# EAGLE design switchableMacroKeyboard (EAGLE 9.5.2)
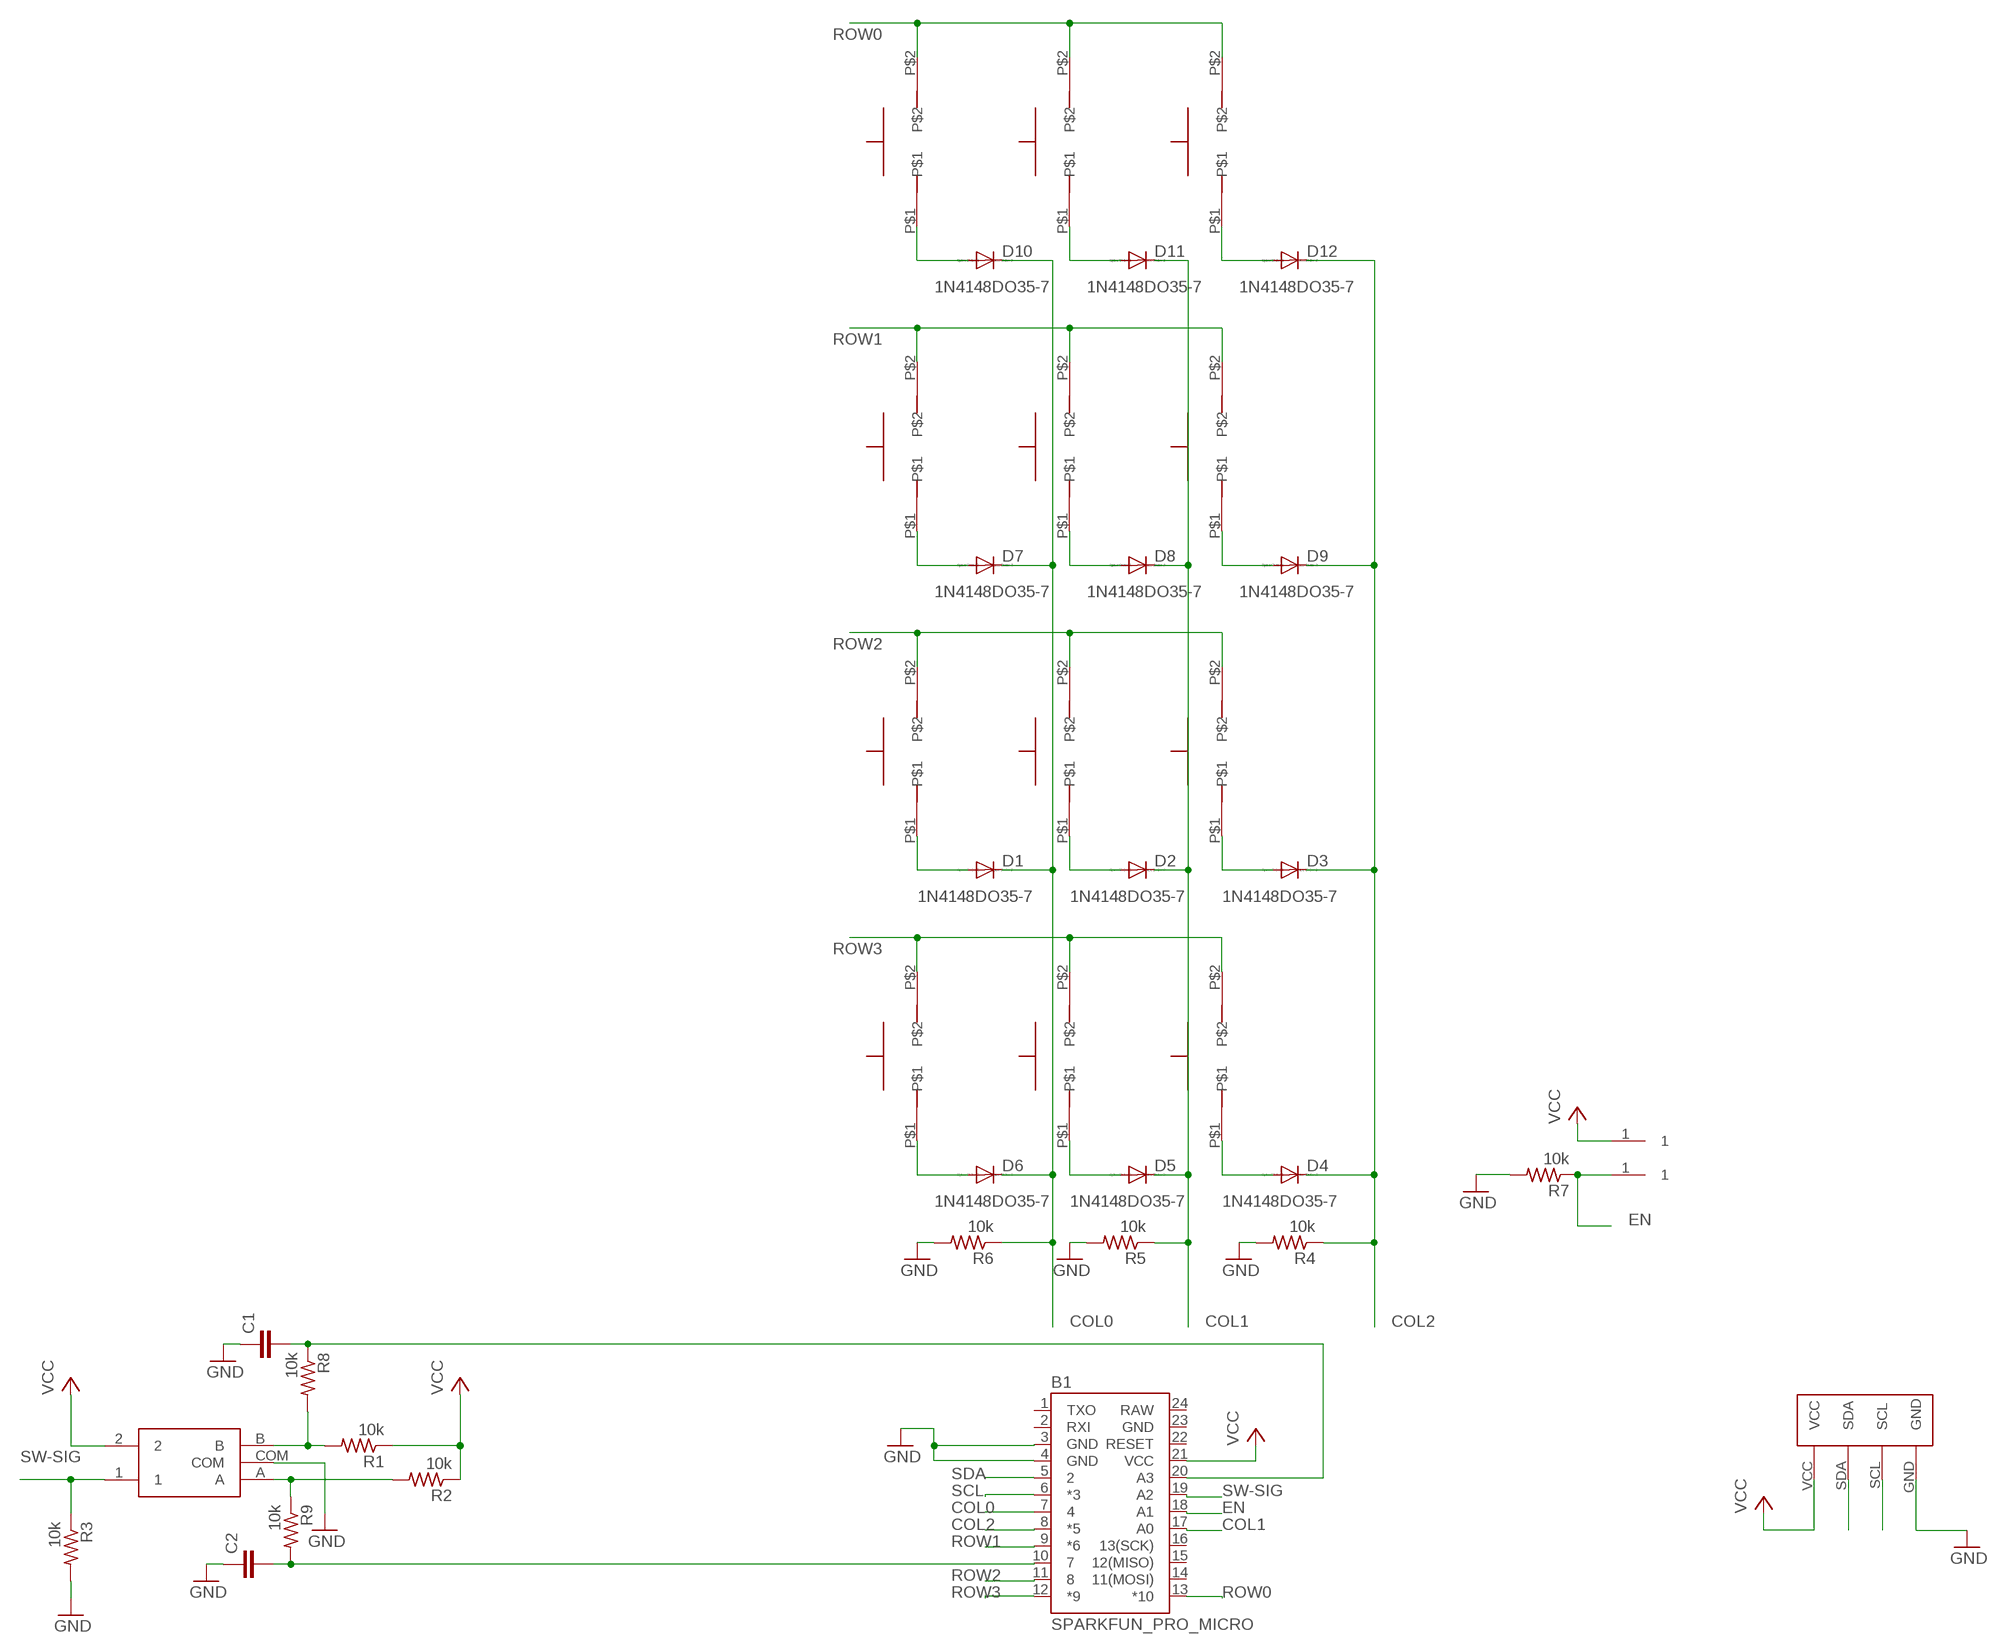
[diagram p0: schematic, sheet 1]

## Parts
B1  SPARKFUN_PRO_MICRO  [SPARKFUN_PRO_MICRO]
C1  C5/2.5  [C5B2.5]
C2  C5/2.5  [C5B2.5]
D1  1N4148DO35-7  [DO35-7]
D2  1N4148DO35-7  [DO35-7]
D3  1N4148DO35-7  [DO35-7]
D4  1N4148DO35-7  [DO35-7]
D5  1N4148DO35-7  [DO35-7]
D6  1N4148DO35-7  [DO35-7]
D7  1N4148DO35-7  [DO35-7]
D8  1N4148DO35-7  [DO35-7]
D9  1N4148DO35-7  [DO35-7]
D10  1N4148DO35-7  [DO35-7]
D11  1N4148DO35-7  [DO35-7]
D12  1N4148DO35-7  [DO35-7]
R1  10k  R-US_0207/10  [0207/10]
R2  10k  R-US_0207/10  [0207/10]
R3  10k  R-US_0207/10  [0207/10]
R4  10k  R-US_0207/10  [0207/10]
R5  10k  R-US_0207/10  [0207/10]
R6  10k  R-US_0207/10  [0207/10]
R7  10k  R-US_0207/10  [0207/10]
R8  10k  R-US_0207/10  [0207/10]
R9  10k  R-US_0207/10  [0207/10]
U$1  TESTPOINT  [TESTPOINT]
U$2  TESTPOINT  [TESTPOINT]
U$3  I2C-100MIL  [I2C-100MIL]
U$4  CHERRYMXBLUE  [CHERRYMXBLUE]
U$5  CHERRYMXBLUE  [CHERRYMXBLUE]
U$6  CHERRYMXBLUE  [CHERRYMXBLUE]
U$7  CHERRYMXBLUE  [CHERRYMXBLUE]
U$8  CHERRYMXBLUE  [CHERRYMXBLUE]
U$9  CHERRYMXBLUE  [CHERRYMXBLUE]
U$10  CHERRYMXBLUE  [CHERRYMXBLUE]
U$11  CHERRYMXBLUE  [CHERRYMXBLUE]
U$12  CHERRYMXBLUE  [CHERRYMXBLUE]
U$13  RE-PEC11R-4315F-S0012  [RE-PEC11R-4315F-S0012]
U$14  CHERRYMXBLUE  [CHERRYMXBLUE]
U$15  CHERRYMXBLUE  [CHERRYMXBLUE]
U$16  CHERRYMXBLUE  [CHERRYMXBLUE]

## Nets
COL0: B1.7 D1.C D6.C D7.C D10.C R6.1
COL1: B1.17(A0) D2.C D5.C D8.C D11.C R5.1
COL2: B1.8(*5) D3.C D4.C D9.C D12.C R4.1
EN: B1.18(A1) R7.1 U$2.1
GND: B1.3(GND) B1.4(GND) C1.1 C2.1 R3.2 R4.2 R5.2 R6.2 R7.2 U$3.GND U$13.COM
N$1: B1.10 C2.2 R9.2
N$2: R1.2 R8.2 U$13.B
N$3: D1.A U$10.P$1
N$4: D2.A U$11.P$1
N$5: D3.A U$12.P$1
N$6: D6.A U$14.P$1
N$7: D5.A U$15.P$1
N$8: D4.A U$16.P$1
N$9: B1.20(A3) C1.2 R8.1
N$10: R2.2 R9.1 U$13.A
N$18: D7.A U$7.P$1
N$19: D8.A U$8.P$1
N$20: D9.A U$9.P$1
N$25: D10.A U$4.P$1
N$26: D11.A U$5.P$1
N$27: D12.A U$6.P$1
ROW0: B1.13(*10) U$4.P$2 U$5.P$2 U$6.P$2
ROW1: B1.9(*6) U$7.P$2 U$8.P$2 U$9.P$2
ROW2: B1.11 U$10.P$2 U$11.P$2 U$12.P$2
ROW3: B1.12(*9) U$14.P$2 U$15.P$2 U$16.P$2
SCL: B1.6(*3) U$3.SCL
SDA: B1.5 U$3.SDA
SW-SIG: B1.19(A2) R3.1 U$13.1
VCC: B1.21(VCC) R1.1 R2.1 U$1.1 U$3.VCC U$13.2
Unconnected: B1.1(TXO) B1.2(RXI) B1.14(11(MOSI)) B1.15(12(MISO)) B1.16(13(SCK)) B1.22(RESET)

## Power pins joined to a net without a drawn wire
GND: B1.23(GND)
RAW: B1.24(RAW)

## Library data of the parts
B1 = SparkFun-Boards:SPARKFUN_PRO_MICRO: SparkFun Pro Micro Atmega32U4 compatible footprint. SparkFun Products: 3.3V/8MHz <https://www.sparkfun.com/products/12587> 5V/16MHz <https://www.sparkfun.com/products/12640>
C1 C2 = capacitor-wima:C: CAPACITOR naming: grid - package width
D1-D12 = diode:1N4148: DIODE high speed (Philips)
R1-R9 = rcl:R-US_: RESISTOR, American symbol; SPICEPREFIX: R
U$1 U$2 = ARNEConnectors:TESTPOINT
U$3 = ARNEConnectors:I2C-100MIL
U$4-U$12 U$14-U$16 = ARNEInput:CHERRYMXBLUE
U$13 = ARNEInput:RE-PEC11R-4315F-S0012

## Board
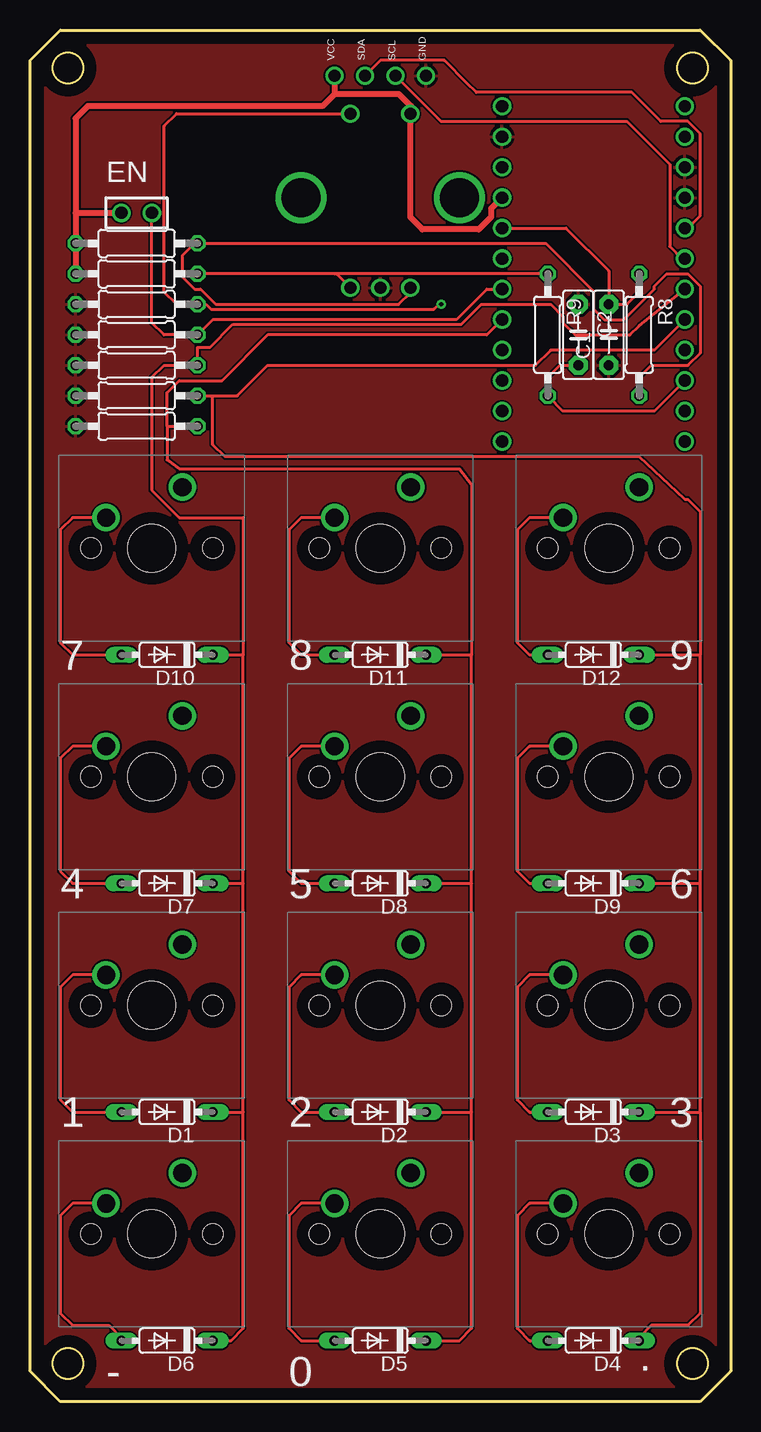
[diagram p1: board, top side]
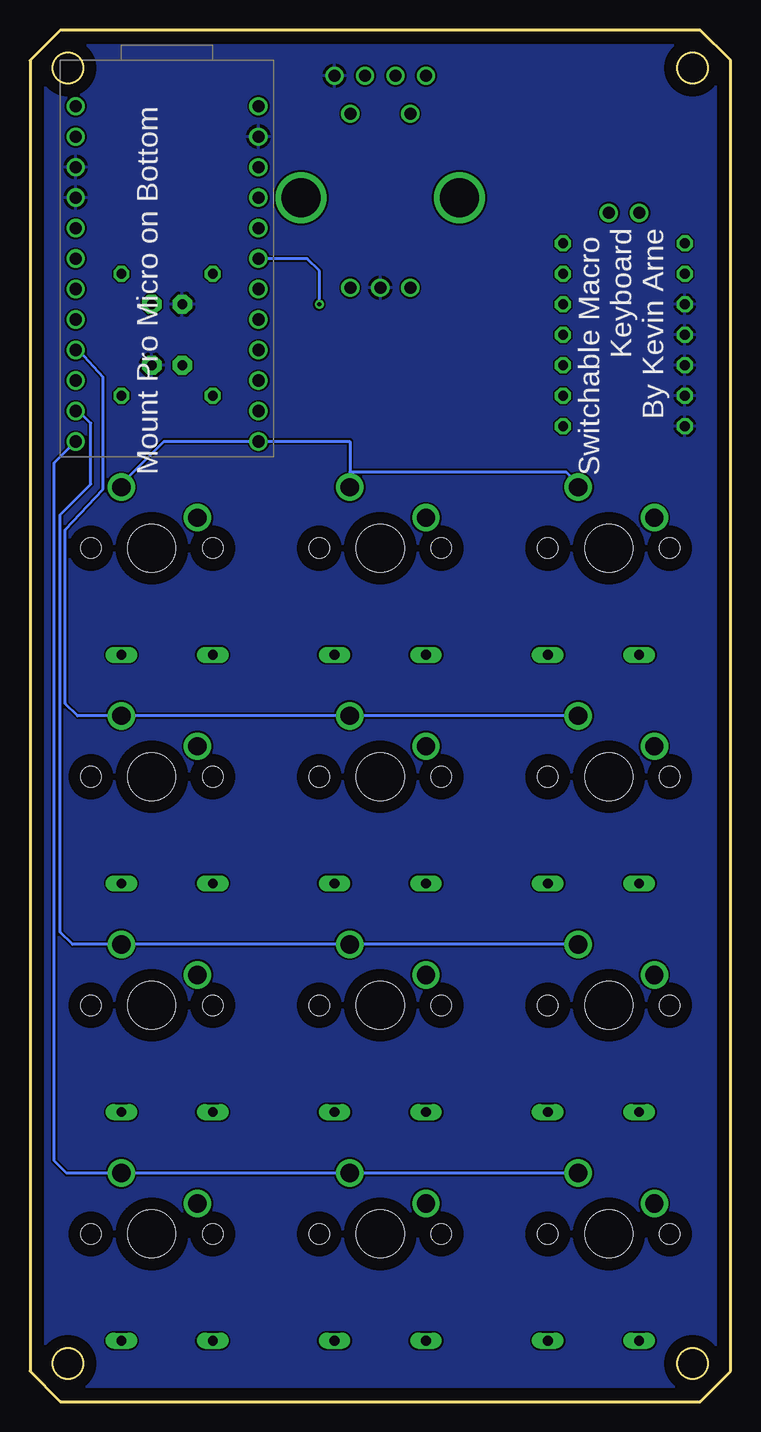
[diagram p2: board, bottom side, seen from below]

Size 58.42 x 114.3 mm. Coordinates in mm from the lower left corner, seen from the top.
Outline: 58.42,111.76 58.42,2.54 55.88,0 2.54,0 0,2.54 0,111.76 2.54,114.3 55.88,114.3 58.42,111.76
Outline: circle at 3.17,3.17 radius 1.27
Outline: circle at 55.24,3.17 radius 1.27
Outline: circle at 3.17,111.12 radius 1.27
Outline: circle at 55.24,111.12 radius 1.27
Copper layers (1*16): Top 0.035mm / dielectric 1.5mm / Bottom 0.035mm
Design rules "default": minimum track width 6mil, minimum drill 0.35mm, track to track 6mil, track to pad 6mil, pad to pad 6mil, via to via 6mil, smd to smd 6mil, copper to edge 40mil, drill to drill 6mil, minimum pad ring 10mil, minimum via ring 8mil, stop-mask expansion 4mil, vias tented up to drill 0mil, thermal gap 10mil

### Footprints (pad centres in the part's own frame; a part is rotated, then mirrored left to right if it is on the bottom)
SPARKFUN_PRO_MICRO = drill 1.016 pad 1.524: 1 -7.62,12.7; 2 -7.62,10.16; 3 -7.62,7.62; 4 -7.62,5.08; 5 -7.62,2.54; 6 -7.62,0; 7 -7.62,-2.54; 8 -7.62,-5.08; 9 -7.62,-7.62; 10 -7.62,-10.16; 11 -7.62,-12.7; 12 -7.62,-15.24; 13 7.62,-15.24; 14 7.62,-12.7; 15 7.62,-10.16; 16 7.62,-7.62; 17 7.62,-5.08; 18 7.62,-2.54; 19 7.62,0; 20 7.62,2.54; 21 7.62,5.08; 22 7.62,7.62; 23 7.62,10.16; 24 7.62,12.7
C5B2.5 = drill 0.813 pad 1.6 octagon: 1 -2.54,0; 2 2.54,0
DO35-7 = drill 0.813 long: A 3.81,0; C -3.81,0
0207/10 = drill 0.813 octagon: 1 -5.08,0; 2 5.08,0
TESTPOINT = drill 1.016: 1 0,0
I2C-100MIL = drill 1.016: GND 3.81,0; SCL 1.27,0; SDA -1.27,0; VCC -3.81,0
CHERRYMXBLUE = drill 1.524: P$1 -3.81,2.54; P$2 2.54,5.08 | hole 3.988: 0,0 | hole 1.702: 5.08,0; -5.08,0
RE-PEC11R-4315F-S0012 = drill 1: 1 -2.5,7; 2 2.5,7; A -2.5,-7.5; B 2.5,-7.5; COM 0,-7.5 | drill 3.25: P$6 -6.6,0; P$7 6.6,0

### Placement (x,y rotation side)
B1  46.99,95.25 0 bottom
C1  48.26,88.9 90 top
C2  45.72,88.9 270 top
D1  11.43,24.13 180 top
D2  29.21,24.13 180 top
D3  46.99,24.13 180 top
D4  46.99,5.08 180 top
D5  29.21,5.08 180 top
D6  11.43,5.08 180 top
D7  11.43,43.18 180 top
D8  29.21,43.18 180 top
D9  46.99,43.18 180 top
D10  11.43,62.23 180 top
D11  29.21,62.23 180 top
D12  46.99,62.23 180 top
R1  8.89,96.52 0 top
R2  8.89,93.98 0 top
R3  8.89,91.44 180 top
R4  8.89,83.82 180 top
R5  8.89,81.28 180 top
R6  8.89,86.36 180 top
R7  8.89,88.9 180 top
R8  50.8,88.9 270 top
R9  43.18,88.9 270 top
U$1  7.62,99.06 0 top
U$2  10.16,99.06 0 top
U$3  29.21,110.49 0 top
U$4  10.16,71.12 0 top
U$5  29.21,71.12 0 top
U$6  48.26,71.12 0 top
U$7  10.16,52.07 0 top
U$8  29.21,52.07 0 top
U$9  48.26,52.07 0 top
U$10  10.16,33.02 0 top
U$11  29.21,33.02 0 top
U$12  48.26,33.02 0 top
U$13  29.21,100.33 0 top
U$14  10.16,13.97 0 top
U$15  29.21,13.97 0 top
U$16  48.26,13.97 0 top

### Tracks (layer width: path | path; a pad name or v marks a point on that pad's centre or on a via)
COL0
  Top 0.254: D6.C 16.76,5.08 17.78,6.1 17.78,24.13 | 17.78,24.13 17.78,43.18 | 17.78,43.18 17.78,62.23 | B1.7 50.8,89.66 50.04,88.9 45.47,88.9 44.45,89.92 44.45,90.42 43.43,91.44 37.64,91.44 35.97,89.76 16.92,89.76 15.01,87.86 13.97,87.86 R6.1 11.18,86.36 10.16,85.34 10.16,75.95 12.45,73.66 17.78,73.66 17.78,62.23 | D10.C 17.78,62.23 | D7.C 17.78,43.18 | D1.C 17.78,24.13
COL1
  Top 0.254: D5.C 35.81,5.08 36.83,6.1 36.83,24.13 | 11.43,81.28 11.43,78.49 12.45,77.72 35.81,77.72 36.83,76.45 36.83,62.23 | 36.83,24.13 36.83,43.18 | 36.83,43.18 36.83,62.23 | 11.43,81.28 R5.1 | 11.43,81.28 11.43,84.07 12.45,85.09 16,85.09 19.81,88.9 38.1,88.9 B1.17 | D2.C 36.83,24.13 | D8.C 36.83,43.18 | D11.C 36.83,62.23
COL2
  Top 0.254: 55.88,24.13 55.88,43.18 | 55.88,43.18 55.88,62.23 | 15.24,83.82 15.24,79.76 16.26,78.74 50.8,78.74 54.61,75.18 54.86,75.18 55.88,74.17 55.88,62.23 | R4.1 15.24,83.82 | 15.24,83.82 17.27,83.82 19.81,86.36 42.16,86.36 43.43,87.63 52.07,87.63 B1.8 | D9.C 55.88,43.18 | D3.C 55.88,24.13 | D12.C 55.88,62.23 | 55.88,24.13 55.88,7.37 54.86,6.35 51.82,6.35 50.8,5.33 D4.C
EN
  Top 0.254: U$2.1 10.16,89.92 11.18,88.9 R7.1 15.24,90.17 35.56,90.17 38.1,92.71 B1.18
GND
  pour Top: 55.88,114.3 2.54,114.3 0,111.76 0,2.54 2.54,0 55.88,0 58.42,2.54 58.42,111.76
  pour Bottom: 55.88,114.3 2.54,114.3 0,111.76 0,2.54 2.54,0 55.88,0 58.42,2.54 58.42,111.76
N$1
  Top 0.254: B1.10 52.07,82.55 44.45,82.55 R9.2 43.18,85.34 44.2,86.36 C2.2
N$2
  Top 0.254: R8.2 50.8,85.34 51.82,86.36 54.86,86.36 55.88,87.38 55.88,92.96 54.86,93.98 53.09,93.98 52.07,92.96 52.07,92.71 49.53,90.17 47.88,90.17 46.99,91.06 46.99,92.53 43,96.52 R1.2 13.72,96.52 12.7,95.5 12.7,93.73 13.72,92.71 14.22,92.71 15.49,91.44 30.73,91.44 31.75,92.46 31.75,92.83 U$13.B
N$3
  Top 0.254: U$10.P$1 3.56,35.56 2.54,34.54 2.54,25.15 3.56,24.13 D1.A
N$4
  Top 0.254: U$11.P$1 22.61,35.56 21.59,34.54 21.59,25.15 22.61,24.13 D2.A
N$5
  Top 0.254: U$12.P$1 41.66,35.56 40.64,34.54 40.64,25.15 41.66,24.13 D3.A
N$6
  Top 0.254: U$14.P$1 3.56,16.51 2.54,15.49 2.54,7.37 3.56,6.35 6.6,6.35 7.62,5.33 D6.A
N$7
  Top 0.254: U$15.P$1 22.61,16.51 21.59,15.49 21.59,6.1 22.61,5.08 D5.A
N$8
  Top 0.254: U$16.P$1 41.66,16.51 40.64,15.49 40.64,6.1 41.66,5.08 D4.A
N$9
  Top 0.254: R8.1 50.8,92.46 49.78,91.44 C1.2 48.26,94.23 44.7,97.79 B1.20
N$10
  Top 0.254: U$13.A 25.56,93.98 | 25.56,93.98 25.4,93.98 R2.2 | R9.1 25.56,93.98
N$18
  Top 0.254: U$7.P$1 3.56,54.61 2.54,53.59 2.54,44.2 3.56,43.18 D7.A
N$19
  Top 0.254: U$8.P$1 22.61,54.61 21.59,53.59 21.59,44.2 22.61,43.18 D8.A
N$20
  Top 0.254: U$9.P$1 41.66,54.61 40.64,53.59 40.64,44.2 41.66,43.18 D9.A
N$25
  Top 0.254: U$4.P$1 3.56,73.66 2.54,72.64 2.54,63.25 3.56,62.23 D10.A
N$26
  Top 0.254: U$5.P$1 22.61,73.66 21.59,72.64 21.59,63.25 22.61,62.23 D11.A
N$27
  Top 0.254: U$6.P$1 41.66,73.66 40.64,72.64 40.64,63.25 41.66,62.23 D12.A
ROW0
  Bottom 0.254: U$6.P$2 50.8,76.45 47.24,80.01 B1.13 31.75,80.01 31.75,77.47 | 31.75,77.47 U$5.P$2 | 31.75,77.47 13.72,77.47 12.7,76.45 U$4.P$2
ROW1
  Bottom 0.254: U$7.P$2 U$8.P$2 U$9.P$2 54.46,57.15 55.47,58.17 55.47,72.64 52.32,76.05 52.32,85.34 54.36,87.63 B1.9
ROW2
  Bottom 0.254: U$10.P$2 U$11.P$2 U$12.P$2 54.86,38.1 55.88,39.12 55.88,73.91 53.34,76.45 53.34,81.53 54.36,82.55 B1.11
ROW3
  Bottom 0.254: B1.12 56.39,78.23 56.39,20.07 55.37,19.05 U$16.P$2 U$15.P$2 U$14.P$2
SCL
  Top 0.254: B1.6 54.36,95.25 53.34,96.27 53.34,103.12 49.78,106.68 34.29,106.68 U$3.SCL
SDA
  Top 0.254: B1.5 54.86,97.79 55.88,98.81 55.88,105.66 54.86,106.68 52.6,106.68 50.19,109.09 37.21,109.09 36.45,109.86 34.54,111.76 29.21,111.76 U$3.SDA
SW-SIG  (via drill 0.35)
  Top 0.254: U$13.1 12.22,107.33 11.2,106.31 11.2,92.46 12.22,91.44 R3.1 14.68,91.44 15.09,91.03 33.68,91.03 34.09,91.44 v34.29,91.44
  Bottom 0.254: v34.29,91.44 34.29,94.23 35.31,95.25 B1.19
VCC
  Top 0.508: B1.21 38.45,99.41 38.45,98.7 37.44,97.69 32.73,97.69 31.71,98.7 U$13.2 31.78,107.4 31.78,107.95 30.77,108.97 25.4,108.97 | U$3.VCC 25.4,108.97 | 25.4,108.97 24.38,107.95 4.83,107.95 3.81,106.93 3.81,99.06 | 3.81,99.06 R1.1 R2.1 | 3.81,99.06 U$1.1

### Text on the board
tPlace: EN | 7 | 8 | 9 | 4 | 5 | 6 | 1 | 2 | 3 | . | - | 0
bPlace: Switchable Macro / Keyboard / By Kevin Arne
bNames: Mount Pro Micro on Bottom